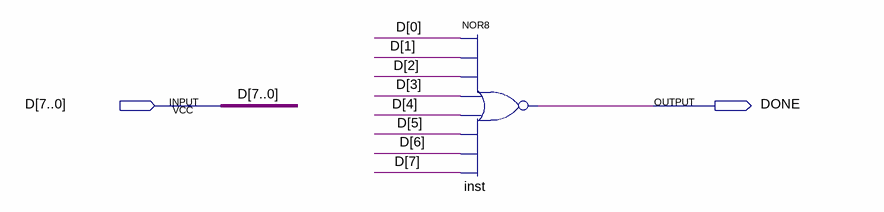
[diagram p0: schematic sheet]
// Quartus schematic DONE.bdf as structural Verilog: 1 symbols, 2 pins
module DONE (
  input  [7:0] D,
  output DONE
);

  nor inst (DONE, D[0], D[1], D[2], D[3], D[4], D[5], D[6], D[7]);
endmodule
